# Altium project TIDA-01486.PrjPcb (part 1 of 2)
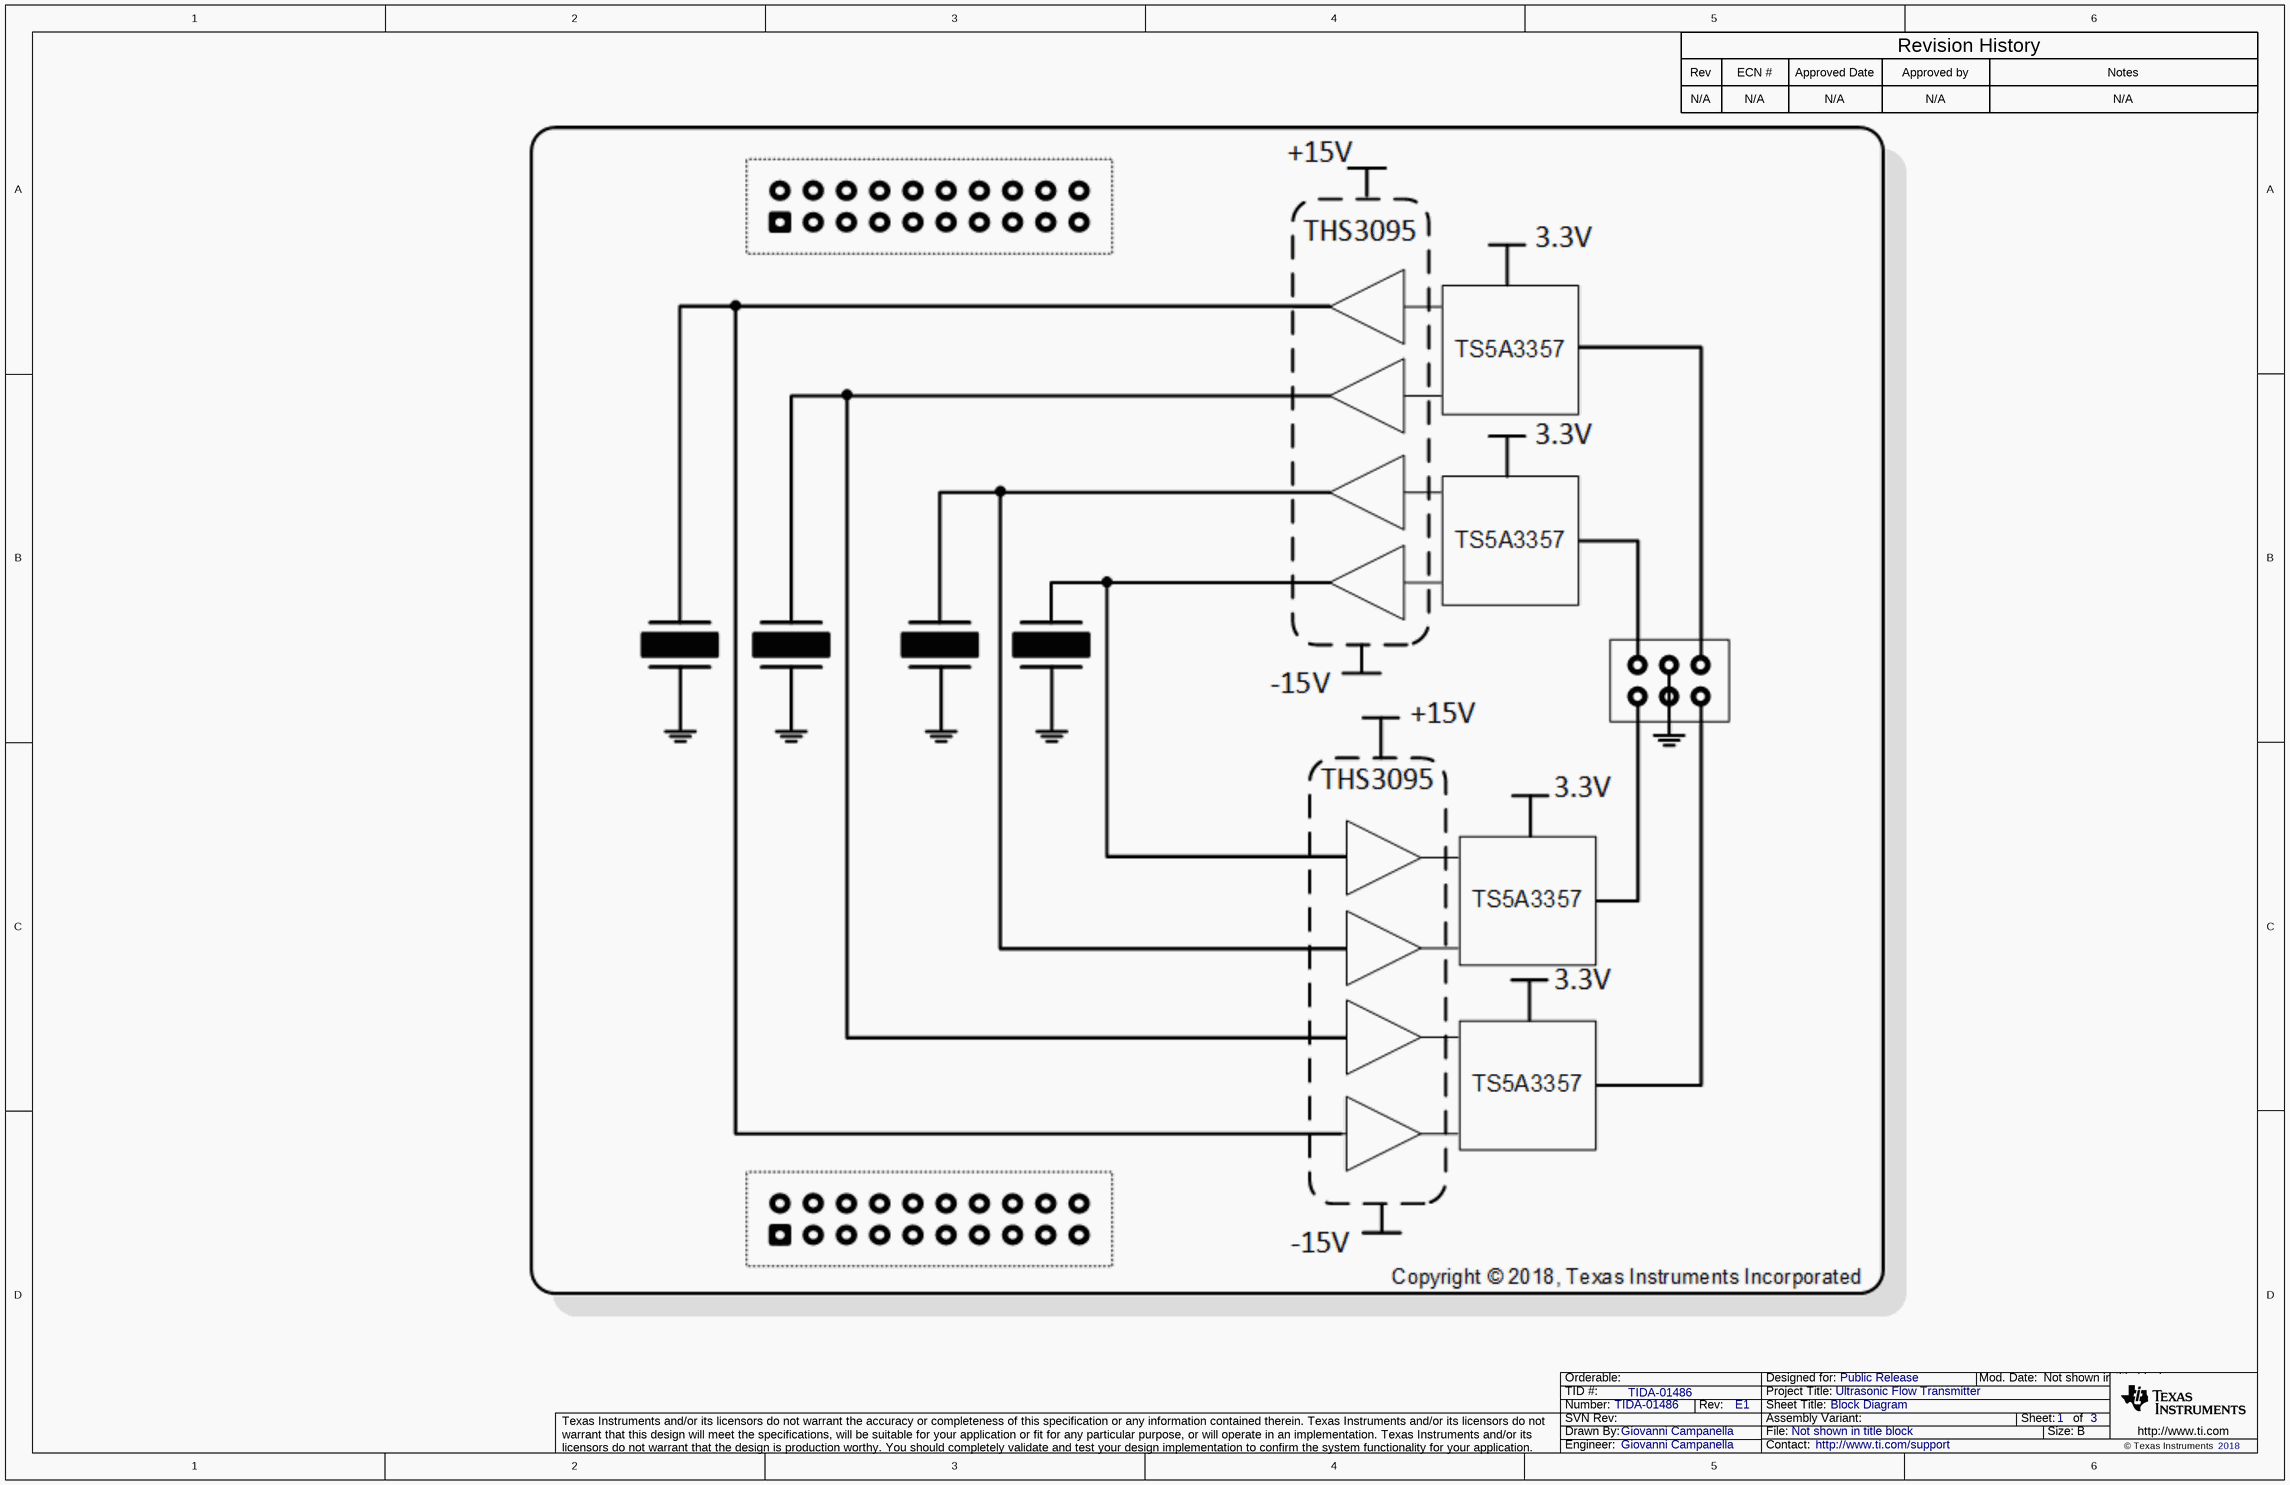
[diagram p0: TIDA-01486E1_CoverSheet.SchDoc]
TID: TIDA-01486; TechSupport: http://www.ti.com/support; SCH_Rev: E1; PRJ_Title: Ultrasonic Flow Transmitter; PRJ_Number: TIDA-01486; PRJ_Engineer: Giovanni Campanella; PRJ_Customer: Public Release; PCB_Rev: E1; PCB_Layout: Giovanni Campanella; CopyrightYear: 2018
3 sheets, 140 parts. Net scope: global (net labels, ports and power ports of the same name join across sheets).
Board file: TIDA-01486E1_PCB.PcbDoc
Sheets:
  TIDA-01486E1_CoverSheet.SchDoc
  TIDA-01486E1_Schematic.SchDoc
  TIDA-01486E1_Hardware.SchDoc

## Sheet TIDA-01486E1_CoverSheet.SchDoc: Block Diagram
size 431 x 279 mm; Date: Not shown in title block; ApprovedBy: Not shown in title block; CheckedBy: Not shown in title block; Author: Not shown in title block; CompanyName: Not shown in title block; DrawnBy: Giovanni Campanella; Engineer: Giovanni Campanella; Organization: Not shown in title block; Address1: Not shown in title block; Address2: Not shown in title block; Address3: Not shown in title block; Address4: Not shown in title block; DocumentNumber: 1; Revision: Use project parameter SCH_Rev; SheetNumber: 1; SheetTotal: 3; PageSetup: Record=PageOptions|CenterHorizontal=True|CenterVertical=True|PrintScale=1.00|XCorrection=1.00|YCorrection=1.00|PrintKind=0|BorderSize=5000000|LeftOffset=0|BottomOffset=0|Orientation=2|PaperLength=1000|PaperWidth=1000|Scale=100|PaperSource=15|PrintQuality=600|MediaType=1|DitherType=10|PaperKind=Letter|PrintScaleMode=1; CurrentTime: Not shown in title block; CurrentDate: Not shown in title block; Time: Not shown in title block; DocumentFullPathAndName: Not shown in title block; DocumentName: Not shown in title block; ModifiedDate: Not shown in title block; ImagePath: Not shown in title block

### Notes on the sheet
- Rev
- N/A
- ECN #
- Approved Date
- Approved by
- Revision History
- Notes
- Drawn By:
- SVN Rev:
- Number:
- TID #:
- Orderable:
- Rev:
- Sheet Title:
- File:
- Project Title:
- Designed for:
- Assembly Variant:
- Mod. Date:
- Sheet:
- Size:
- of
- B
- http://www.ti.com
- Texas Instruments and/or its licensors do not warrant the accuracy or completeness of this specification or any information contained therein. Texas Instruments and/or its licensors do not warrant that this design will meet the specifications, will be suitable for your application or fit for any particular purpose, or will operate in an implementation. Texas Instruments and/or its licensors do not warrant that the design is production worthy. You should completely validate and test your design implementation to confirm the system functionality for your application.
- Engineer:
- Contact:
- © Texas Instruments

## Sheet TIDA-01486E1_Schematic.SchDoc: Schematic
size E; Date: Not shown in title block; ApprovedBy: Not shown in title block; CheckedBy: Not shown in title block; Author: Not shown in title block; CompanyName: Not shown in title block; DrawnBy: Giovanni Campanella; Engineer: Giovanni Campanella; Organization: Not shown in title block; Address1: Not shown in title block; Address2: Not shown in title block; Address3: Not shown in title block; Address4: Not shown in title block; DocumentNumber: 1; Revision: Use project parameter SCH_Rev; SheetNumber: 2; SheetTotal: 3; PageSetup: Record=PageOptions|CenterHorizontal=True|CenterVertical=True|PrintScale=1.00|XCorrection=1.00|YCorrection=1.00|PrintKind=0|BorderSize=5000000|LeftOffset=0|BottomOffset=0|Orientation=2|PaperLength=1000|PaperWidth=1000|Scale=100|PaperSource=15|PrintQuality=600|MediaType=1|DitherType=10|PaperKind=Letter|PrintScaleMode=1; CurrentTime: Not shown in title block; CurrentDate: Not shown in title block; Time: Not shown in title block; DocumentFullPathAndName: Not shown in title block; DocumentName: Not shown in title block; ModifiedDate: Not shown in title block; ImagePath: Not shown in title block
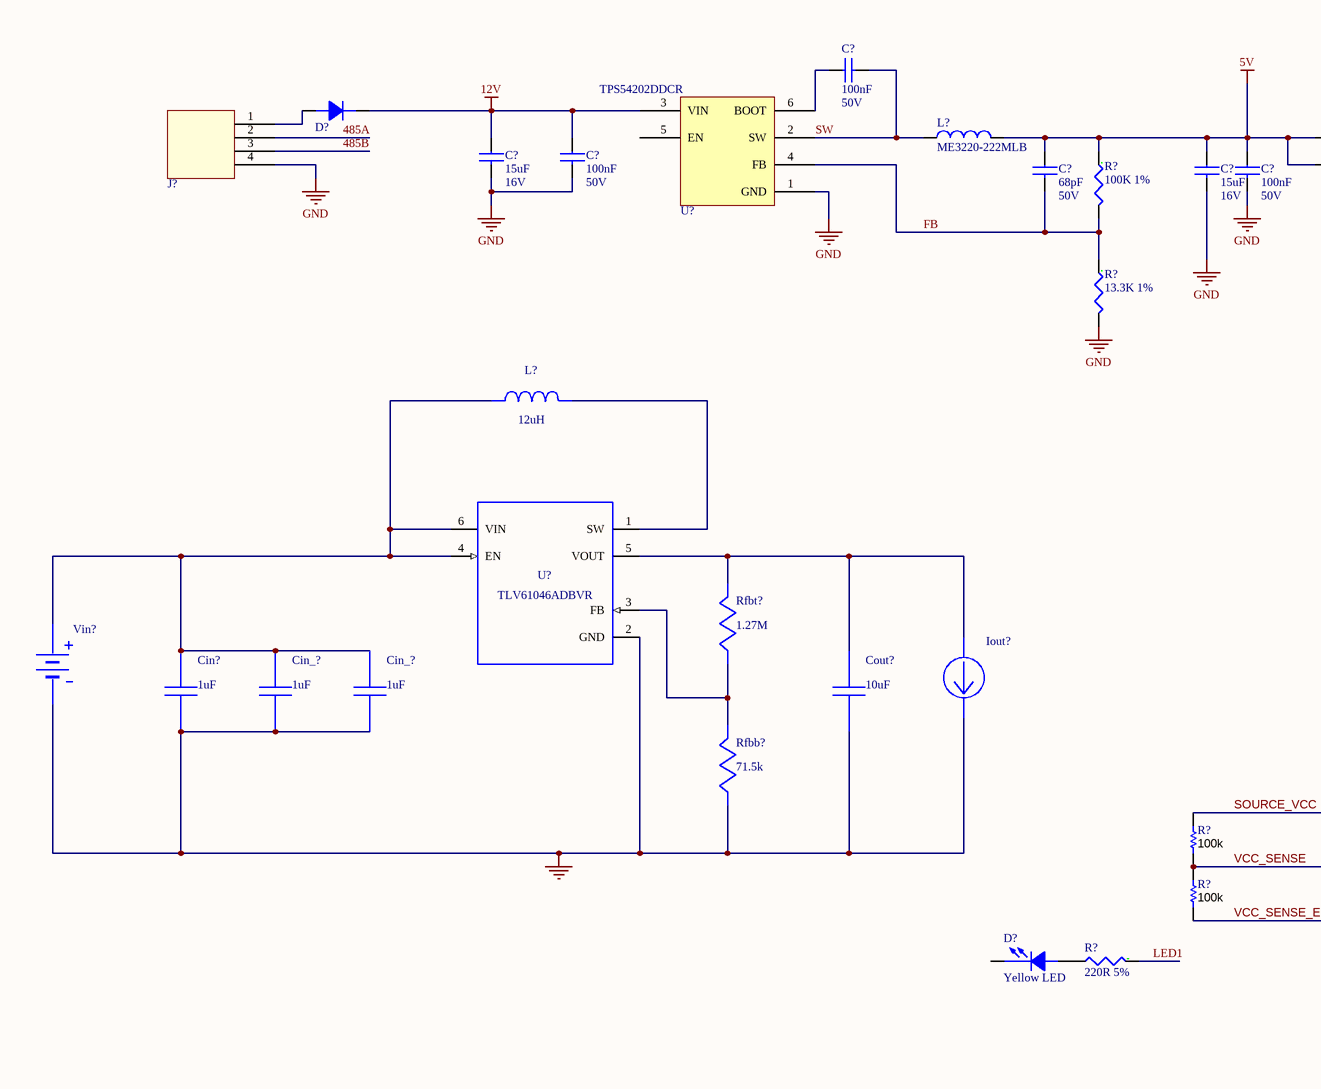
[diagram p1: TIDA-01486E1_Schematic.SchDoc, top left]
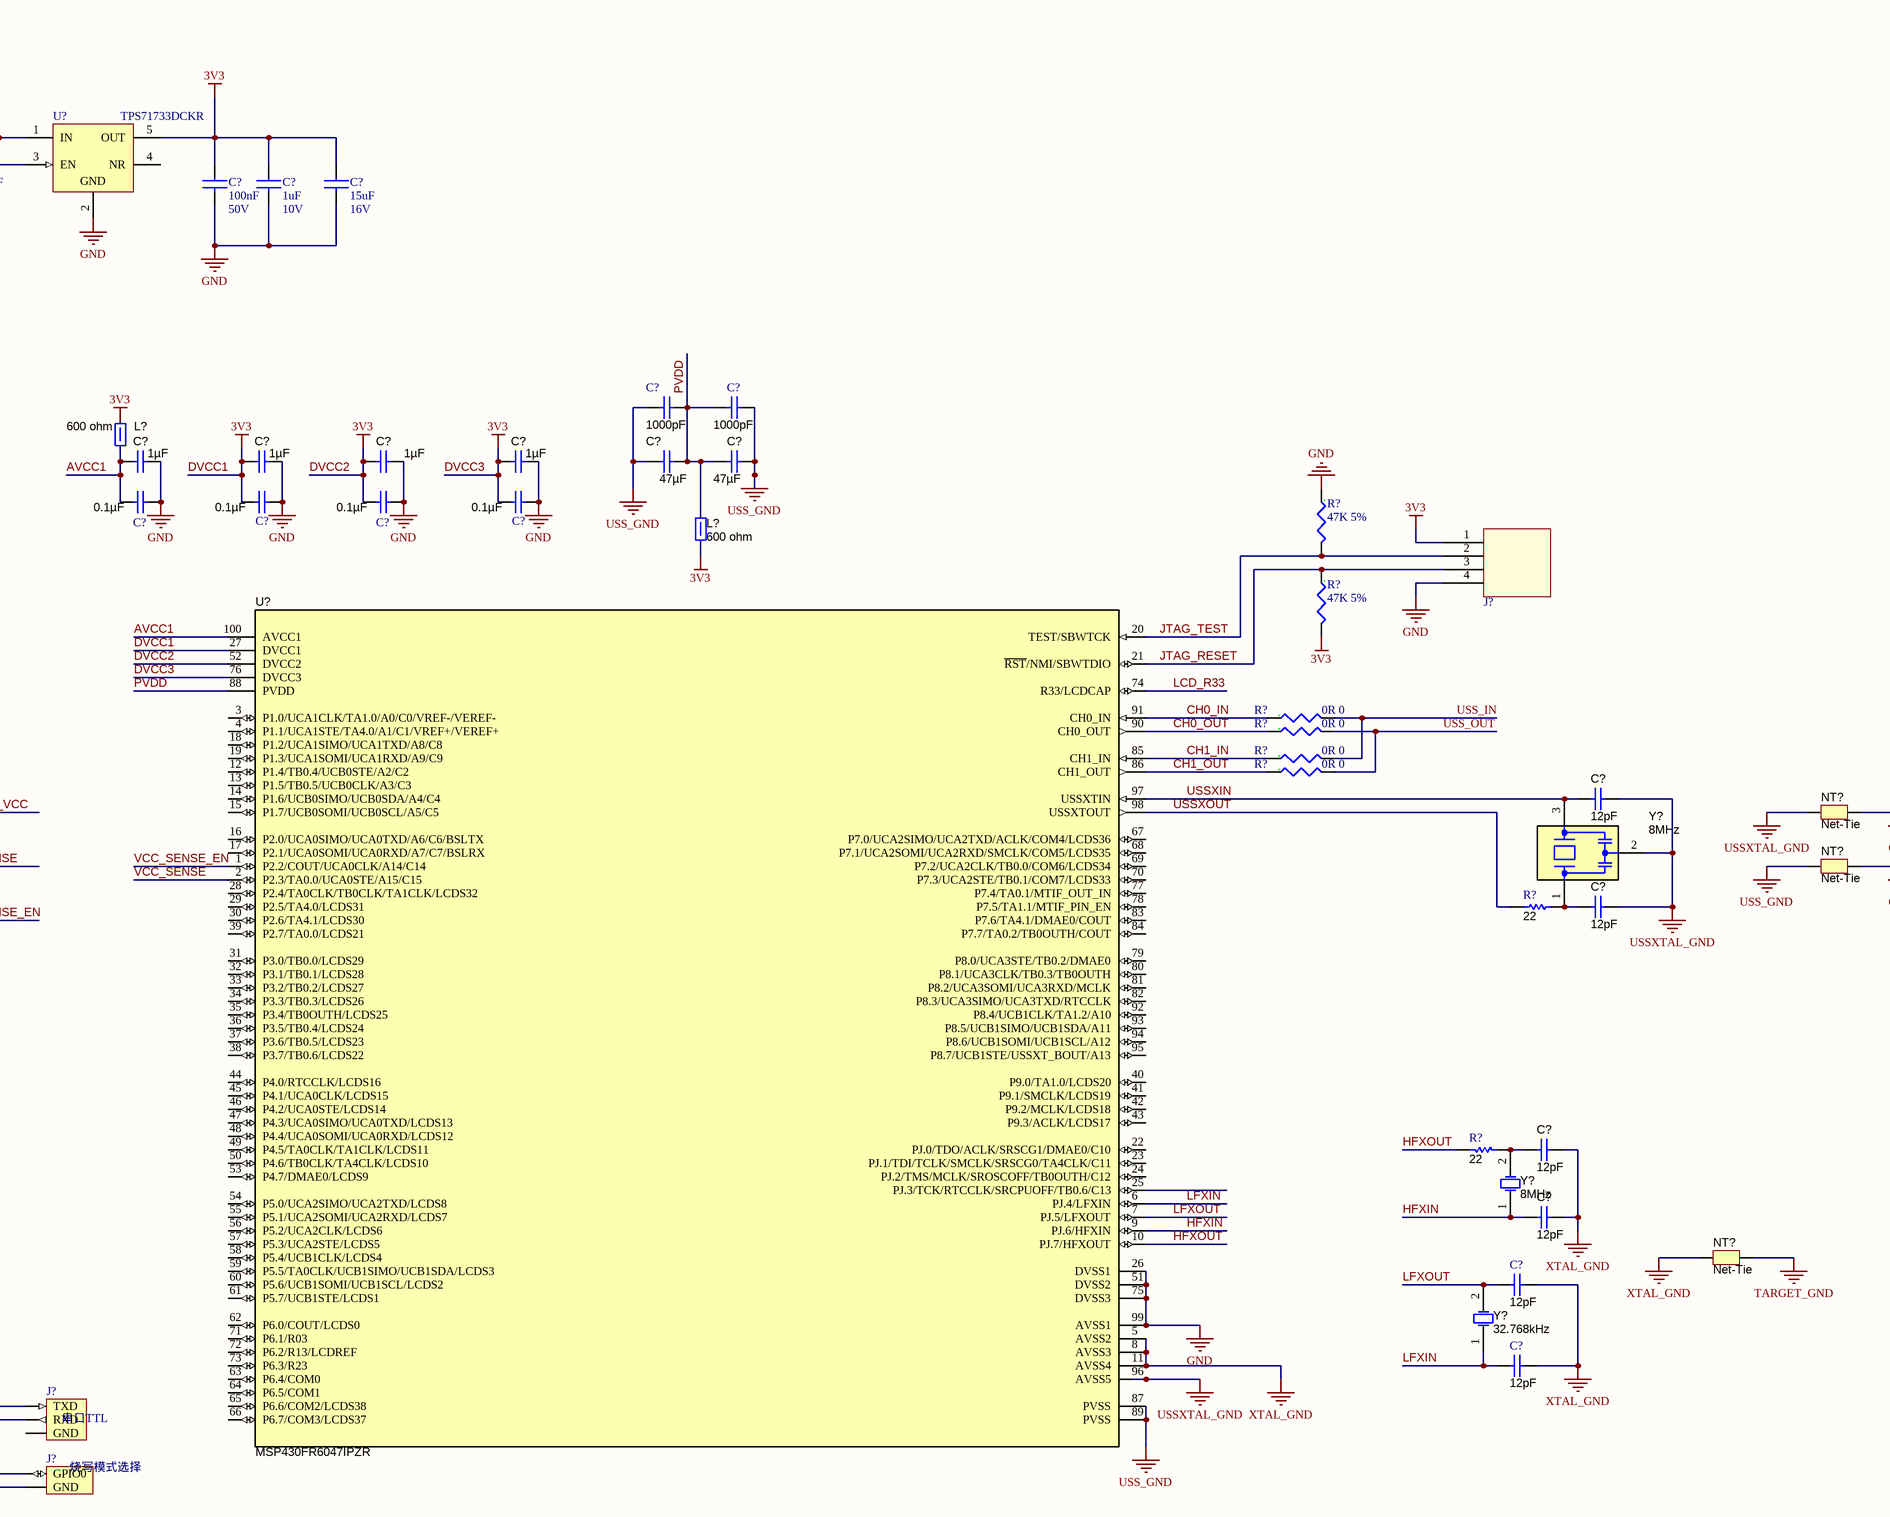
[diagram p2: TIDA-01486E1_Schematic.SchDoc, top middle]
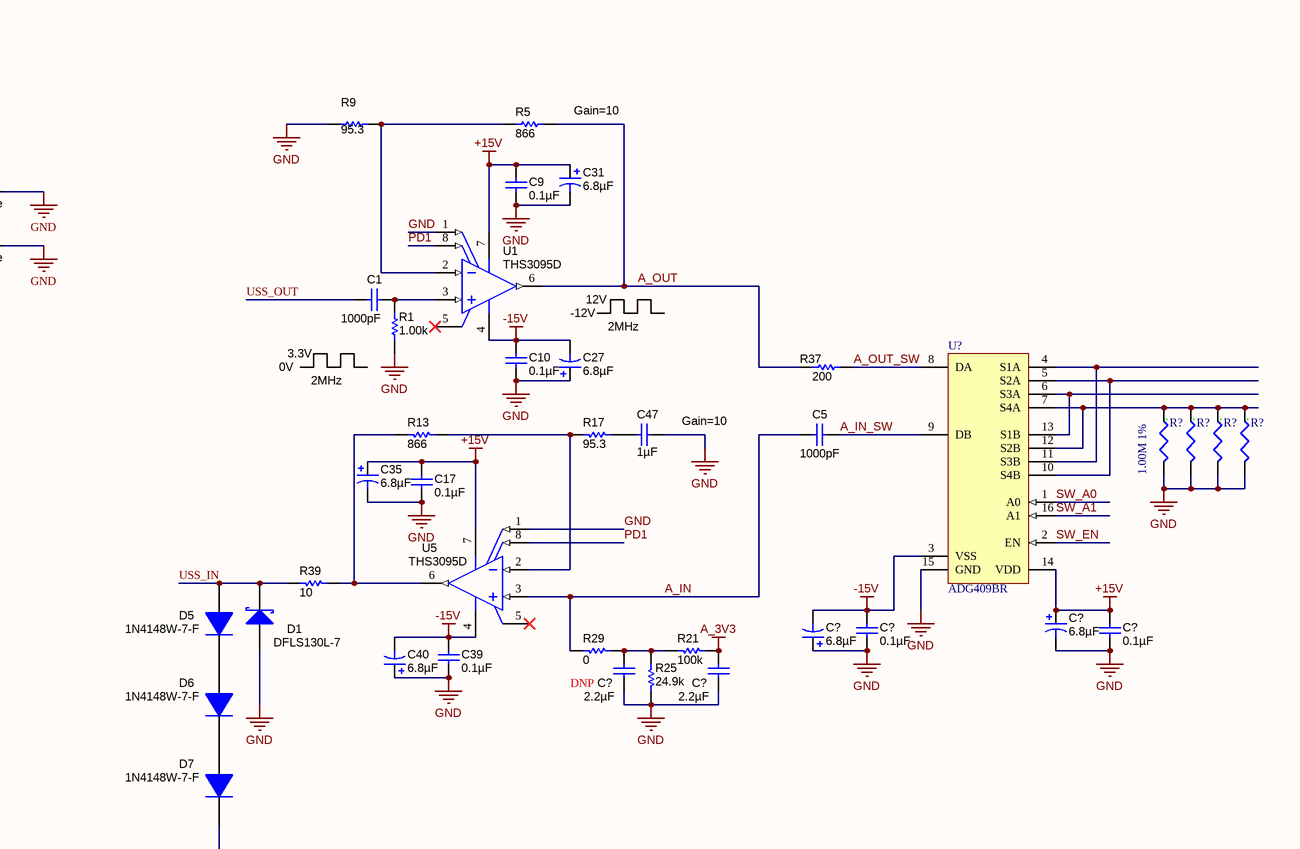
[diagram p3: TIDA-01486E1_Schematic.SchDoc, top right]
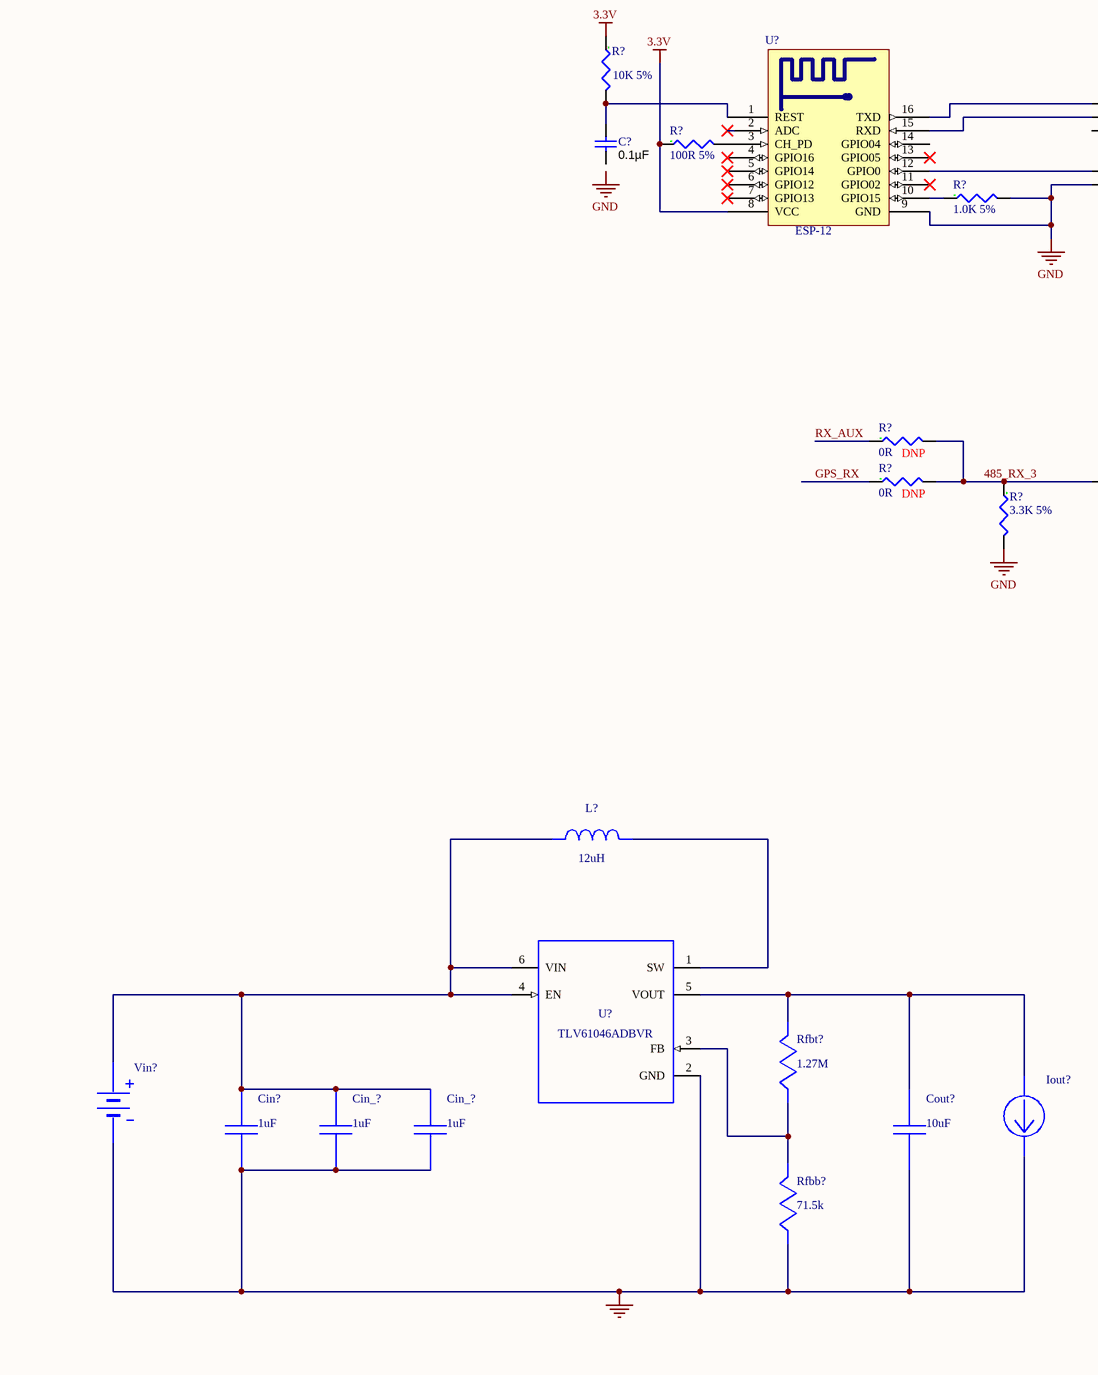
[diagram p4: TIDA-01486E1_Schematic.SchDoc, bottom left]
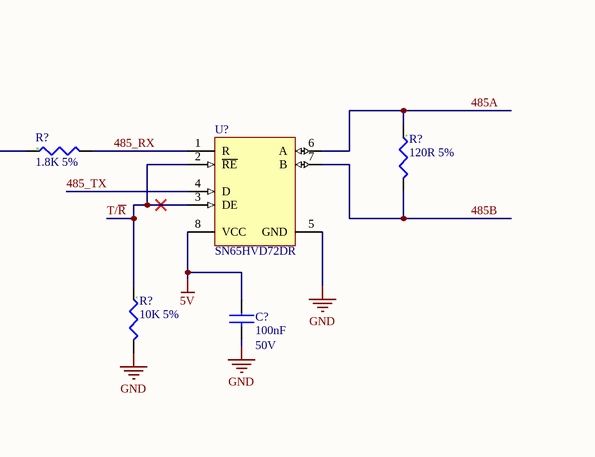
[diagram p5: TIDA-01486E1_Schematic.SchDoc, bottom middle]
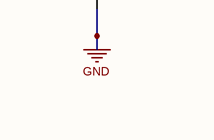
[diagram p6: TIDA-01486E1_Schematic.SchDoc, bottom right]

### Parts
(Parts that share a designator on the sheet are numbered #1, #2 ... from top to bottom, then left to right.)
C1  ValueDisplayed: 1000pF  [0603]  (hidden comment: GRM188R71H102JA01D)
C5  ValueDisplayed: 1000pF  [0603]  (hidden comment: GRM188R71H102JA01D)
C9  ValueDisplayed: 0.1µF  [0402]  (hidden comment: GRM155R71E104KE14D)
C10  ValueDisplayed: 0.1µF  [0402]  (hidden comment: GRM155R71E104KE14D)
C17  ValueDisplayed: 0.1µF  [0402]  (hidden comment: GRM155R71E104KE14D)
C27  ValueDisplayed: 6.8µF  [3216-18]  (hidden comment: TPSA685K020R1000)
C31  ValueDisplayed: 6.8µF  [3216-18]  (hidden comment: TPSA685K020R1000)
C35  ValueDisplayed: 6.8µF  [3216-18]  (hidden comment: TPSA685K020R1000)
C39  ValueDisplayed: 0.1µF  [0402]  (hidden comment: GRM155R71E104KE14D)
C40  ValueDisplayed: 6.8µF  [3216-18]  (hidden comment: TPSA685K020R1000)
C47  ValueDisplayed: 1µF  [0603]  (hidden comment: GMK107AB7105KAHT)
C?#1  value 100nF  Rated Voltage: 50V  [C_0603C]  (hidden comment: 100nF 50V)
C?#2  value 15uF  Rated Voltage: 16V  [C_1210C]  (hidden comment: 15uF 16V)
C?#3  value 100nF  Rated Voltage: 50V  [C_0603C]  (hidden comment: 100nF 50V)
C?#4  value 68pF  Rated Voltage: 50V  [C_0603C]  (hidden comment: 68pF 50V)
C?#5  value 15uF  Rated Voltage: 16V  [C_1210C]  (hidden comment: 15uF 16V)
C?#6  value 100nF  Rated Voltage: 50V  [C_0603C]  (hidden comment: 100nF 50V)
C?#7  value 100nF  Rated Voltage: 50V  [C_0603C]  (hidden comment: 100nF 50V)
C?#8  value 1uF  Rated Voltage: 10V  [C_0603C]  (hidden comment: 1uF 10V)
C?#9  value 15uF  Rated Voltage: 16V  [C_1210C]  (hidden comment: 15uF 16V)
C?#10  ValueDisplayed: 1000pF  [0402S]  (hidden comment: GRM1555C1H102JA01D)
C?#11  ValueDisplayed: 1000pF  [0402S]  (hidden comment: GRM1555C1H102JA01D)
C?#12  ValueDisplayed: 1µF  [0603S]  (hidden comment: GRM188R71A105KA61D)
C?#13  ValueDisplayed: 1µF  [0603S]  (hidden comment: GRM188R71A105KA61D)
C?#14  ValueDisplayed: 1µF  [0603S]  (hidden comment: GRM188R71A105KA61D)
C?#15  ValueDisplayed: 1µF  [0603S]  (hidden comment: GRM188R71A105KA61D)
C?#16  ValueDisplayed: 47µF  [0805L]  (hidden comment: GRM21BR60J476ME15L)
C?#17  ValueDisplayed: 47µF  [0805L]  (hidden comment: GRM21BR60J476ME15L)
C?#18  ValueDisplayed: 0.1µF  [0402S]  (hidden comment: GRM155R71C104KA88D)
C?#19  ValueDisplayed: 0.1µF  [0402S]  (hidden comment: GRM155R71C104KA88D)
C?#20  ValueDisplayed: 0.1µF  [0402S]  (hidden comment: GRM155R71C104KA88D)
C?#21  ValueDisplayed: 0.1µF  [0402S]  (hidden comment: GRM155R71C104KA88D)
C?#22  ValueDisplayed: 12pF  [0402]  (hidden comment: GRM1555C1H120JA01D)
C?#23  ValueDisplayed: 12pF  [0402]  (hidden comment: GRM1555C1H120JA01D)
C?#24  ValueDisplayed: 12pF  [0402]  (hidden comment: GRM1555C1H120JA01D)
C?#25  ValueDisplayed: 12pF  [0402]  (hidden comment: GRM1555C1H120JA01D)
C?#26  ValueDisplayed: 6.8µF  [3216-18]  (hidden comment: TPSA685K020R1000)
C?#27  ValueDisplayed: 0.1µF  [0402]  (hidden comment: GRM155R71E104KE14D)
C?#28  ValueDisplayed: 6.8µF  [3216-18]  (hidden comment: TPSA685K020R1000)
C?#29  ValueDisplayed: 0.1µF  [0402]  (hidden comment: GRM155R71E104KE14D)
C?#30  ValueDisplayed: 12pF  [0402S]  (hidden comment: GRM1555C1H120JA01D)
C?#31  ValueDisplayed: 2.2µF  ASSY: DNP  [0603]  (hidden comment: EMK107BB7225MA-T)
C?#32  ValueDisplayed: 2.2µF  [0603]  (hidden comment: EMK107BB7225MA-T)
C?#33  ValueDisplayed: 12pF  [0402S]  (hidden comment: GRM1555C1H120JA01D)
C?#34  ValueDisplayed: 0.1µF  [0402S]  (hidden comment: GRM155R71C104KA88D)
C?#35  value 100nF  Rated Voltage: 50V  [C_0603C]  (hidden comment: 100nF 50V)
Cin?#1  value 1uF  (hidden comment: C0603C105K8PACTU)
Cin?#2  value 1uF  (hidden comment: C0603C105K8PACTU)
Cin_?#1  value 1uF  (hidden comment: C0603C105K8PACTU)
Cin_?#2  value 1uF  (hidden comment: C0603C105K8PACTU)
Cin_?#3  value 1uF  (hidden comment: C0603C105K8PACTU)
Cin_?#4  value 1uF  (hidden comment: C0603C105K8PACTU)
Cout?#1  value 10uF  (hidden comment: CL32B106KBJNNWE)
Cout?#2  value 10uF  (hidden comment: CL32B106KBJNNWE)
D1  DFLS130L-7  [PowerDI123]
D5  1N4148W-7-F  [SOD-123]
D6  1N4148W-7-F  [SOD-123]
D7  1N4148W-7-F  [SOD-123]
D?#1  Diode 3.0A 3A 50V SMC  [DIODE-SMC]  (value not drawn)
D?#2  Yellow LED  [C_0603D]
Iout?#1  WB_CURRENT_LOAD  (value not drawn)
Iout?#2  WB_CURRENT_LOAD  (value not drawn)
J?#1  MOLEX 22-23-2041  [MOLEX_22-23-2041]  (value not drawn)
J?#2  MSP340 PROG PADS  [MSP430PROG]  (value not drawn)
J?#3  USART  (value not drawn)
J?#4  GPIO0  (value not drawn)
L?#1  Manufacturer Part Number: ME3220-222MLB  [ME3220]  (hidden comment: ME3220 2.2uH)
L?#2  value 12uH  (hidden comment: NPI43C120MTRF)
L?#3  value 600 ohm  [0805L]  (hidden comment: MPZ2012S601A)
L?#4  value 600 ohm  [0805L]  (hidden comment: MPZ2012S601A)
L?#5  value 12uH  (hidden comment: NPI43C120MTRF)
NT?#1  Net-Tie  [Net-Tie_50milWide_30milLong]  (net tie, no BOM)
NT?#2  Net-Tie  [Net-Tie_50milWide_30milLong]  (net tie, no BOM)
NT?#3  Net-Tie  [Net-Tie_50milWide_30milLong]  (net tie, no BOM)
R1  ValueDisplayed: 1.00k  [0603]  (hidden comment: RC0603FR-071KL)
R5  ValueDisplayed: 866  [0603]  (hidden comment: CRCW0603866RFKEA)
R9  ValueDisplayed: 95.3  [0603]  (hidden comment: CRCW060395R3FKEA)
R13  ValueDisplayed: 866  [0603]  (hidden comment: CRCW0603866RFKEA)
R17  ValueDisplayed: 95.3  [0603]  (hidden comment: CRCW060395R3FKEA)
R21  ValueDisplayed: 100k  [0603]  (hidden comment: RT0603BRD07100KL)
R25  ValueDisplayed: 24.9k  [0603]  (hidden comment: RT0603BRD0724K9L)
R29  ValueDisplayed: 0  [0603]  (hidden comment: RMCF0603ZT0R00)
R37  ValueDisplayed: 200  [0402]  (hidden comment: CRCW0402200RFKED)
R39  ValueDisplayed: 10  [0603]  (hidden comment: CRCW060310R0JNEAHP)
R?#1  100K 1%  [C_0603R]
R?#2  13.3K 1%  [C_0603R]
R?#3  47K 5%  [C_0603R]
R?#4  47K 5%  [C_0603R]
R?#5  0R 0  [C_0603R]
R?#6  0R 0  [C_0603R]
R?#7  0R 0  [C_0603R]
R?#8  0R 0  [C_0603R]
R?#9  ValueDisplayed: 100k  [0402S]  (hidden comment: CRCW0402100KJNED)
R?#10  ValueDisplayed: 100k  [0402S]  (hidden comment: CRCW0402100KJNED)
R?#11  ValueDisplayed: 22  [0402S]  (hidden comment: CRCW040222R0JNED)
R?#12  220R 5%  [C_0603R]
R?#13  1.00M 1%  [C_0603R]
R?#14  1.00M 1%  [C_0603R]  (value not drawn)
R?#15  1.00M 1%  [C_0603R]  (value not drawn)
R?#16  1.00M 1%  [C_0603R]  (value not drawn)
R?#17  ValueDisplayed: 22  [0402S]  (hidden comment: CRCW040222R0JNED)
R?#18  10K 5%  [C_0603R]
R?#19  100R 5%  [C_0603R]
R?#20  1.0K 5%  [C_0603R]
R?#21  0R  ASSY_OPT: DNP  [C_0603R]
R?#22  120R 5%  [C_0603R]
R?#23  0R  ASSY_OPT: DNP  [C_0603R]
R?#24  3.3K 5%  [C_0603R]
R?#25  1.8K 5%  [C_0603R]
R?#26  10K 5%  [C_0603R]
Rfbb?#1  value 71.5k  (hidden comment: CRCW040271K5FKED)
Rfbb?#2  value 71.5k  (hidden comment: CRCW040271K5FKED)
Rfbt?#1  value 1.27M  (hidden comment: CRCW04021M27FKED)
Rfbt?#2  value 1.27M  (hidden comment: CRCW04021M27FKED)
U1  THS3095D  [D0008A_N]
U5  THS3095D  [D0008A_N]
U?#1  TPS54202DDCR  [SOT23-6_TPS54202]
U?#2  TPS71733DCKR  [SOT23-5]
U?#3  TLV61046ADBVR
U?#4  ADG409BR  [ADI-R-16_L]
U?#5  MSP430FR6047IPZR  [PZ0100A_N]
U?#6  ESP-12  (value not drawn)
U?#7  SN65HVD72DR  [D0008A_M]
U?#8  TLV61046ADBVR
Vin?#1  WB_BATTERY  (value not drawn)
Vin?#2  WB_BATTERY  (value not drawn)
Y?#1  Frequency: 8MHz  [Abracon_AWSCR-CV]  (hidden comment: AWSCR-8.00CV-T)
Y?#2  Frequency: 8MHz  [Abracon_ABM3]  (hidden comment: ABM3-8.000MHZ-D2Y-T)
Y?#3  Frequency: 32.768kHz  [XTAL_ABS07]  (hidden comment: ABS07-32.768KHZ-9-T)

### Nets
0: Cin?#1.2 Cin?#2.2 Cin_?#1.2 Cin_?#2.2 Cin_?#3.2 Cin_?#4.2 Cout?#1.2 Cout?#2.2 Iout?#1.2(-) Iout?#2.2(-) Rfbb?#1.2 Rfbb?#2.2 U?#3.2(GND) U?#8.2(GND) Vin?#1.2(-) Vin?#2.2(-)
3.3V: R?#18.1 R?#19.1 U?#6.8(VCC)
5V: C?#4.1 C?#5.1 C?#6.1 C?#35.1 L?#1.2 R?#1.1 U?#2.1(IN) U?#2.3(EN) U?#7.8(VCC)
12V: C?#2.1 C?#3.1 D?#1.C(K) U?#1.3(VIN)
+15V: C9.1 C17.1 C31.1(+) C35.1(+) C?#28.1(+) C?#29.1 U1.7(VS+) U5.7(VS+) U?#4.14(VDD)
-15V: C10.1 C27.2(-) C39.1 C40.2(-) C?#26.2(-) C?#27.1 U1.4(VS-) U5.4(VS-) U?#4.3(VSS)
A_3V3: C?#32.1 R21.1
DVCC1: C?#7.1 C?#8.1 C?#9.1 C?#13.1 C?#14.2 C?#15.1 C?#19.2 C?#20.1 C?#21.1 J?#2.1 L?#3.2 L?#4.2 R?#4.2 U?#2.5(OUT) U?#5.27(DVCC1) U?#5.52(DVCC2) U?#5.76(DVCC3)  [also labelled 3V3, DVCC2, DVCC3]
GND: C9.2 C10.2 C17.2 C27.1(+) C31.2(-) C35.2(-) C39.2 C40.1(+) C47.2 C?#2.2 C?#3.2 C?#5.2 C?#6.2 C?#7.2 C?#8.2 C?#9.2 C?#12.2 C?#13.2 C?#14.1 C?#15.2 C?#18.2 C?#19.1 C?#20.2 C?#21.2 C?#26.1(+) C?#27.2 C?#28.2(-) C?#29.2 C?#31.2 C?#32.2 C?#35.2 D1.2(A) D7.1(K) J?#1.4 J?#2.4 J?#4.2(GND) NT?#1.2 NT?#2.2 R1.1 R9.1 R25.1 R?#2.2 R?#3.1 R?#13.2 R?#14.2 R?#15.2 R?#16.2 R?#20.2 R?#24.2 R?#26.2 U1.1(REF) U5.1(REF) U?#1.1(GND) U?#2.2(GND) U?#4.15(GND) U?#5.26(DVSS1) U?#5.51(DVSS2) U?#5.75(DVSS3) U?#5.99(AVSS1) U?#6.9(GND) U?#7.5(GND)
TARGET_GND: NT?#3.2
USS_GND: C?#10.2 C?#11.1 C?#16.1 C?#17.2 NT?#2.1 U?#5.87(PVSS) U?#5.89(PVSS)
USSXTAL_GND: C?#22.2 C?#23.2 NT?#1.1 U?#5.96(AVSS5) Y?#1.2(GND)
XTAL_GND: C?#24.2 C?#25.2 C?#30.1 C?#33.2 NT?#3.1 U?#5.5(AVSS2) U?#5.8(AVSS3) U?#5.11(AVSS4)
485_RX: R?#25.2 U?#7.1(R)
485_RX_3: R?#21.2 R?#23.2 R?#24.1 R?#25.1
485_TX: U?#7.4(D)
485A: J?#1.2 R?#22.1 U?#7.6(A)
485B: J?#1.3 R?#22.2 U?#7.7(B)
A_IN: C5.2 R29.2 U5.3(VIN+)
A_IN_SW: C5.1 U?#4.9(DB)
A_OUT: R5.2 R37.1 U1.6(VOUT)
A_OUT_SW: R37.2 U?#4.8(DA)
AVCC1: C?#12.1 C?#18.1 L?#3.1 U?#5.100(AVCC1)
CH0_IN: R?#5.1 U?#5.91(CH0_IN)
CH0_OUT: R?#6.1 U?#5.90(CH0_OUT)
CH1_IN: R?#7.1 U?#5.85(CH1_IN)
CH1_OUT: R?#8.1 U?#5.86(CH1_OUT)
FB: C?#4.2 R?#1.2 R?#2.1 U?#1.4(FB)
GPS_RX: R?#23.1
HFXIN: C?#25.1 U?#5.9(PJ.6/HFXIN) Y?#2.1(OSC1)
HFXOUT: R?#17.2 U?#5.10(PJ.7/HFXOUT)
JTAG_RESET: J?#2.3 R?#4.1 U?#5.21(~{RST}/NMI/SBWTDIO)
JTAG_TEST: J?#2.2 R?#3.2 U?#5.20(TEST/SBWTCK)
LCD_R33: U?#5.74(R33/LCDCAP)
LED1: R?#12.1
LFXIN: C?#33.1 U?#5.6(PJ.4/LFXIN) Y?#3.1(OSC1)
LFXOUT: C?#30.2 U?#5.7(PJ.5/LFXOUT) Y?#3.2(OSC2)
PD1: U1.8(~{PD}) U5.8(~{PD})
PVDD: C?#10.1 C?#11.2 C?#16.2 C?#17.1 L?#4.1 U?#5.88(PVDD)
RX_AUX: R?#21.1
SOURCE_VCC: R?#9.2
SW: C?#1.2 L?#1.1 U?#1.2(SW)
SW_A0: U?#4.1(A0)
SW_A1: U?#4.16(A1)
SW_EN: U?#4.2(EN)
T/~{R}: R?#26.1 U?#7.2(~{RE}) U?#7.3(DE)
USS_IN: D1.1(K) D5.2(A) R39.2 R?#5.2 R?#7.2
USS_OUT: C1.2 R?#6.2 R?#8.2
USSXIN: C?#22.1 U?#5.97(USSXTIN) Y?#1.3(Out)
USSXOUT: R?#11.2 U?#5.98(USSXTOUT)
VCC_SENSE: R?#9.1 R?#10.2 U?#5.2(P2.3/TA0.0/UCA0STE/A15/C15)
VCC_SENSE_EN: R?#10.1 U?#5.1(P2.2/COUT/UCA0CLK/A14/C14)
NetC1_1: C1.1 R1.2 U1.3(VIN+)
NetC47_1: C47.1 R17.1
NetC?#1_1: C?#1.1 U?#1.6(BOOT)
NetC?#23_1: C?#23.1 R?#11.1 Y?#1.1(In)
NetC?#24_1: C?#24.1 R?#17.1 Y?#2.2(OSC2)
NetC?#31_1: C?#31.1 R21.2 R25.2 R29.1
NetC?#34_2: C?#34.2 R?#18.2 U?#6.1(REST)
NetCin?#1_1: Cin?#1.1 Cin_?#1.1 Cin_?#2.1 L?#2.1 U?#3.4(EN) U?#3.6(VIN) Vin?#1.1(+)
NetCin?#2_1: Cin?#2.1 Cin_?#3.1 Cin_?#4.1 L?#5.1 U?#8.4(EN) U?#8.6(VIN) Vin?#2.1(+)
NetCout?#1_1: Cout?#1.1 Iout?#1.1(+) Rfbt?#1.1 U?#3.5(VOUT)
NetCout?#2_1: Cout?#2.1 Iout?#2.1(+) Rfbt?#2.1 U?#8.5(VOUT)
NetD5_1: D5.1(K) D6.2(A)
NetD6_1: D6.1(K) D7.2(A)
NetD?#1_A: D?#1.A J?#1.1
NetD?#2_1: D?#2.1(A) R?#12.2
NetJ?#3_1: J?#3.1(TXD) U?#6.16(TXD)
NetJ?#3_2: J?#3.2(RXD) U?#6.15(RXD)
NetJ?#4_1: J?#4.1(GPIO0) U?#6.12(GPIO0)
NetL?#2_2: L?#2.2 U?#3.1(SW)
NetL?#5_2: L?#5.2 U?#8.1(SW)
NetR5_1: R5.1 R9.2 U1.2(VIN-)
NetR13_1: R13.1 R17.2 U5.2(VIN-)
NetR13_2: R13.2 R39.1 U5.6(VOUT)
NetR?#13_1: R?#13.1 R?#14.1 R?#15.1 R?#16.1 U?#4.7(S4A) U?#4.12(S2B)
NetR?#19_2: R?#19.2 U?#6.3(CH_PD)
NetR?#20_1: R?#20.1 U?#6.10(GPIO15)
NetRfbb?#1_1: Rfbb?#1.1 Rfbt?#1.2 U?#3.3(FB)
NetRfbb?#2_1: Rfbb?#2.1 Rfbt?#2.2 U?#8.3(FB)
NetU?#4_4: U?#4.4(S1A) U?#4.11(S3B)
NetU?#4_5: U?#4.5(S2A) U?#4.10(S4B)
NetU?#4_6: U?#4.6(S3A) U?#4.13(S1B)

Not connected (* = marked no-connect by the designer): C?#34 1; D?#2 2(C); J?#3 3(GND); U1 5(NC)*; U5 5(NC)*; U?#1 5(EN); U?#2 4(NR); U?#5 3(P1.0/UCA1CLK/TA1.0/A0/C0/VREF-/VEREF-) 4(P1.1/UCA1STE/TA4.0/A1/C1/VREF+/VEREF+) 12(P1.4/TB0.4/UCB0STE/A2/C2) 13(P1.5/TB0.5/UCB0CLK/A3/C3) 14(P1.6/UCB0SIMO/UCB0SDA/A4/C4) 15(P1.7/UCB0SOMI/UCB0SCL/A5/C5) 16(P2.0/UCA0SIMO/UCA0TXD/A6/C6/BSLTX) 17(P2.1/UCA0SOMI/UCA0RXD/A7/C7/BSLRX) 18(P1.2/UCA1SIMO/UCA1TXD/A8/C8) 19(P1.3/UCA1SOMI/UCA1RXD/A9/C9) 22(PJ.0/TDO/ACLK/SRSCG1/DMAE0/C10) 23(PJ.1/TDI/TCLK/SMCLK/SRSCG0/TA4CLK/C11) 24(PJ.2/TMS/MCLK/SROSCOFF/TB0OUTH/C12) 25(PJ.3/TCK/RTCCLK/SRCPUOFF/TB0.6/C13) 28(P2.4/TA0CLK/TB0CLK/TA1CLK/LCDS32) 29(P2.5/TA4.0/LCDS31) 30(P2.6/TA4.1/LCDS30) 31(P3.0/TB0.0/LCDS29) 32(P3.1/TB0.1/LCDS28) 33(P3.2/TB0.2/LCDS27) 34(P3.3/TB0.3/LCDS26) 35(P3.4/TB0OUTH/LCDS25) 36(P3.5/TB0.4/LCDS24) 37(P3.6/TB0.5/LCDS23) 38(P3.7/TB0.6/LCDS22) 39(P2.7/TA0.0/LCDS21) 40(P9.0/TA1.0/LCDS20) 41(P9.1/SMCLK/LCDS19) 42(P9.2/MCLK/LCDS18) 43(P9.3/ACLK/LCDS17) 44(P4.0/RTCCLK/LCDS16) 45(P4.1/UCA0CLK/LCDS15) 46(P4.2/UCA0STE/LCDS14) 47(P4.3/UCA0SIMO/UCA0TXD/LCDS13) 48(P4.4/UCA0SOMI/UCA0RXD/LCDS12) 49(P4.5/TA0CLK/TA1CLK/LCDS11) 50(P4.6/TB0CLK/TA4CLK/LCDS10) 53(P4.7/DMAE0/LCDS9) 54(P5.0/UCA2SIMO/UCA2TXD/LCDS8) 55(P5.1/UCA2SOMI/UCA2RXD/LCDS7) 56(P5.2/UCA2CLK/LCDS6) 57(P5.3/UCA2STE/LCDS5) 58(P5.4/UCB1CLK/LCDS4) 59(P5.5/TA0CLK/UCB1SIMO/UCB1SDA/LCDS3) 60(P5.6/UCB1SOMI/UCB1SCL/LCDS2) 61(P5.7/UCB1STE/LCDS1) 62(P6.0/COUT/LCDS0) 63(P6.4/COM0) 64(P6.5/COM1) 65(P6.6/COM2/LCDS38) 66(P6.7/COM3/LCDS37) 67(P7.0/UCA2SIMO/UCA2TXD/ACLK/COM4/LCDS36) 68(P7.1/UCA2SOMI/UCA2RXD/SMCLK/COM5/LCDS35) 69(P7.2/UCA2CLK/TB0.0/COM6/LCDS34) 70(P7.3/UCA2STE/TB0.1/COM7/LCDS33) 71(P6.1/R03) 72(P6.2/R13/LCDREF) 73(P6.3/R23) 77(P7.4/TA0.1/MTIF_OUT_IN) 78(P7.5/TA1.1/MTIF_PIN_EN) 79(P8.0/UCA3STE/TB0.2/DMAE0) 80(P8.1/UCA3CLK/TB0.3/TB0OUTH) 81(P8.2/UCA3SOMI/UCA3RXD/MCLK) 82(P8.3/UCA3SIMO/UCA3TXD/RTCCLK) 83(P7.6/TA4.1/DMAE0/COUT) 84(P7.7/TA0.2/TB0OUTH/COUT) 92(P8.4/UCB1CLK/TA1.2/A10) 93(P8.5/UCB1SIMO/UCB1SDA/A11) 94(P8.6/UCB1SOMI/UCB1SCL/A12) 95(P8.7/UCB1STE/USSXT_BOUT/A13); U?#6 2(ADC)* 4(GPIO16)* 5(GPIO14)* 6(GPIO12)* 7(GPIO13)* 11(GPIO02)* 13(GPIO05)* 14(GPIO04)

### Notes on the sheet
- (near R5) Gain=10
- (near C27) -12V
- 12V
- 0V
- 3.3V
- 2MHz
- (near C27) 2MHz
- (near C47) Gain=10
- (near J?#3) 串口TTL
- (near J?#4) 烧写模式选择
- (near U?#6) ESP-12
- Labels drawn without touching a wire or pin: GND
- Title
- Size:
- Date:
- File:
- E
- Number:
- Time:
- Revision:
- Sheet
- of